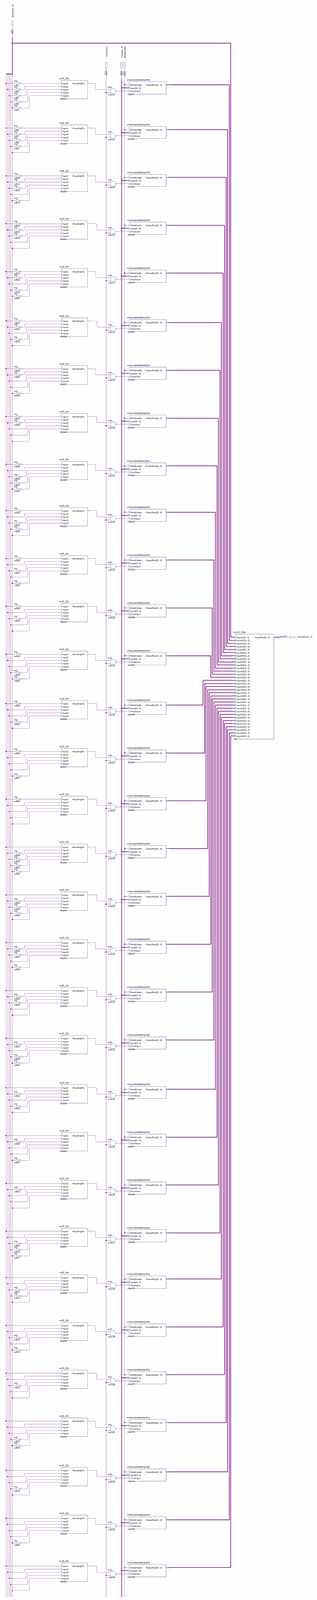
[diagram p0: schematic sheet, whole]
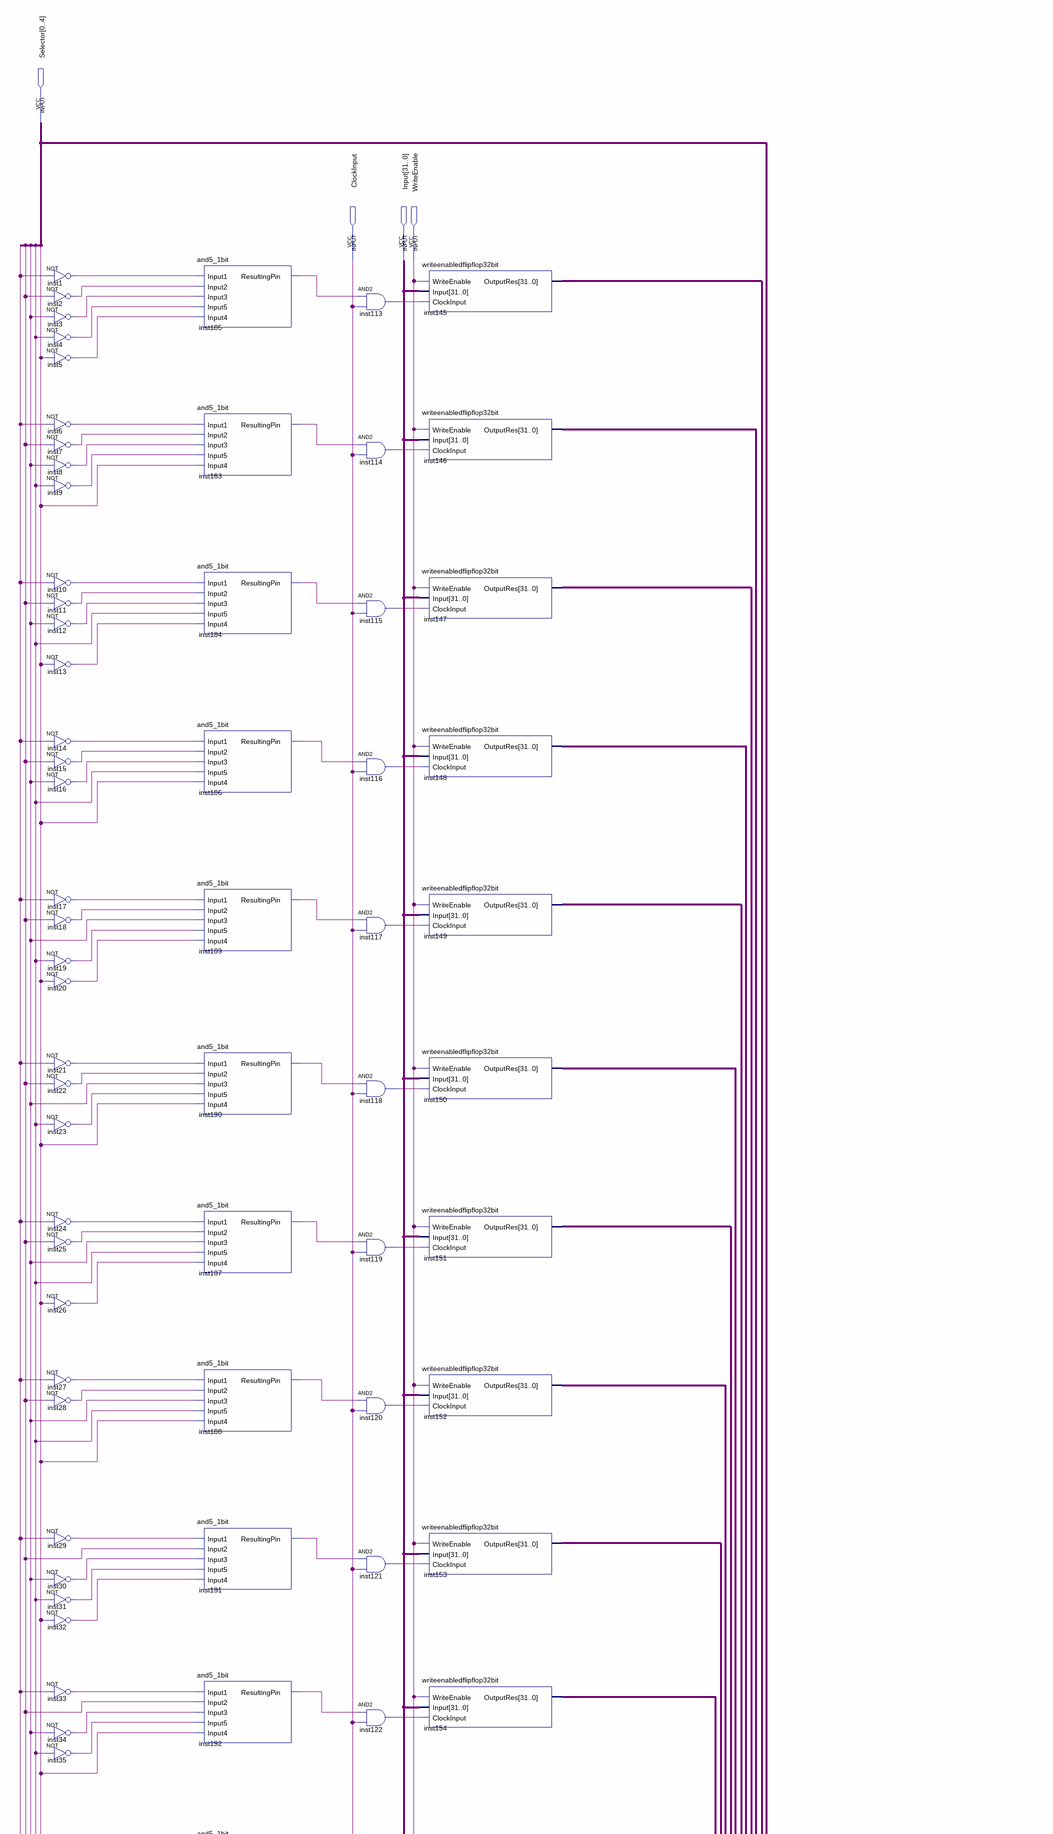
[diagram p1: schematic sheet, upper part]
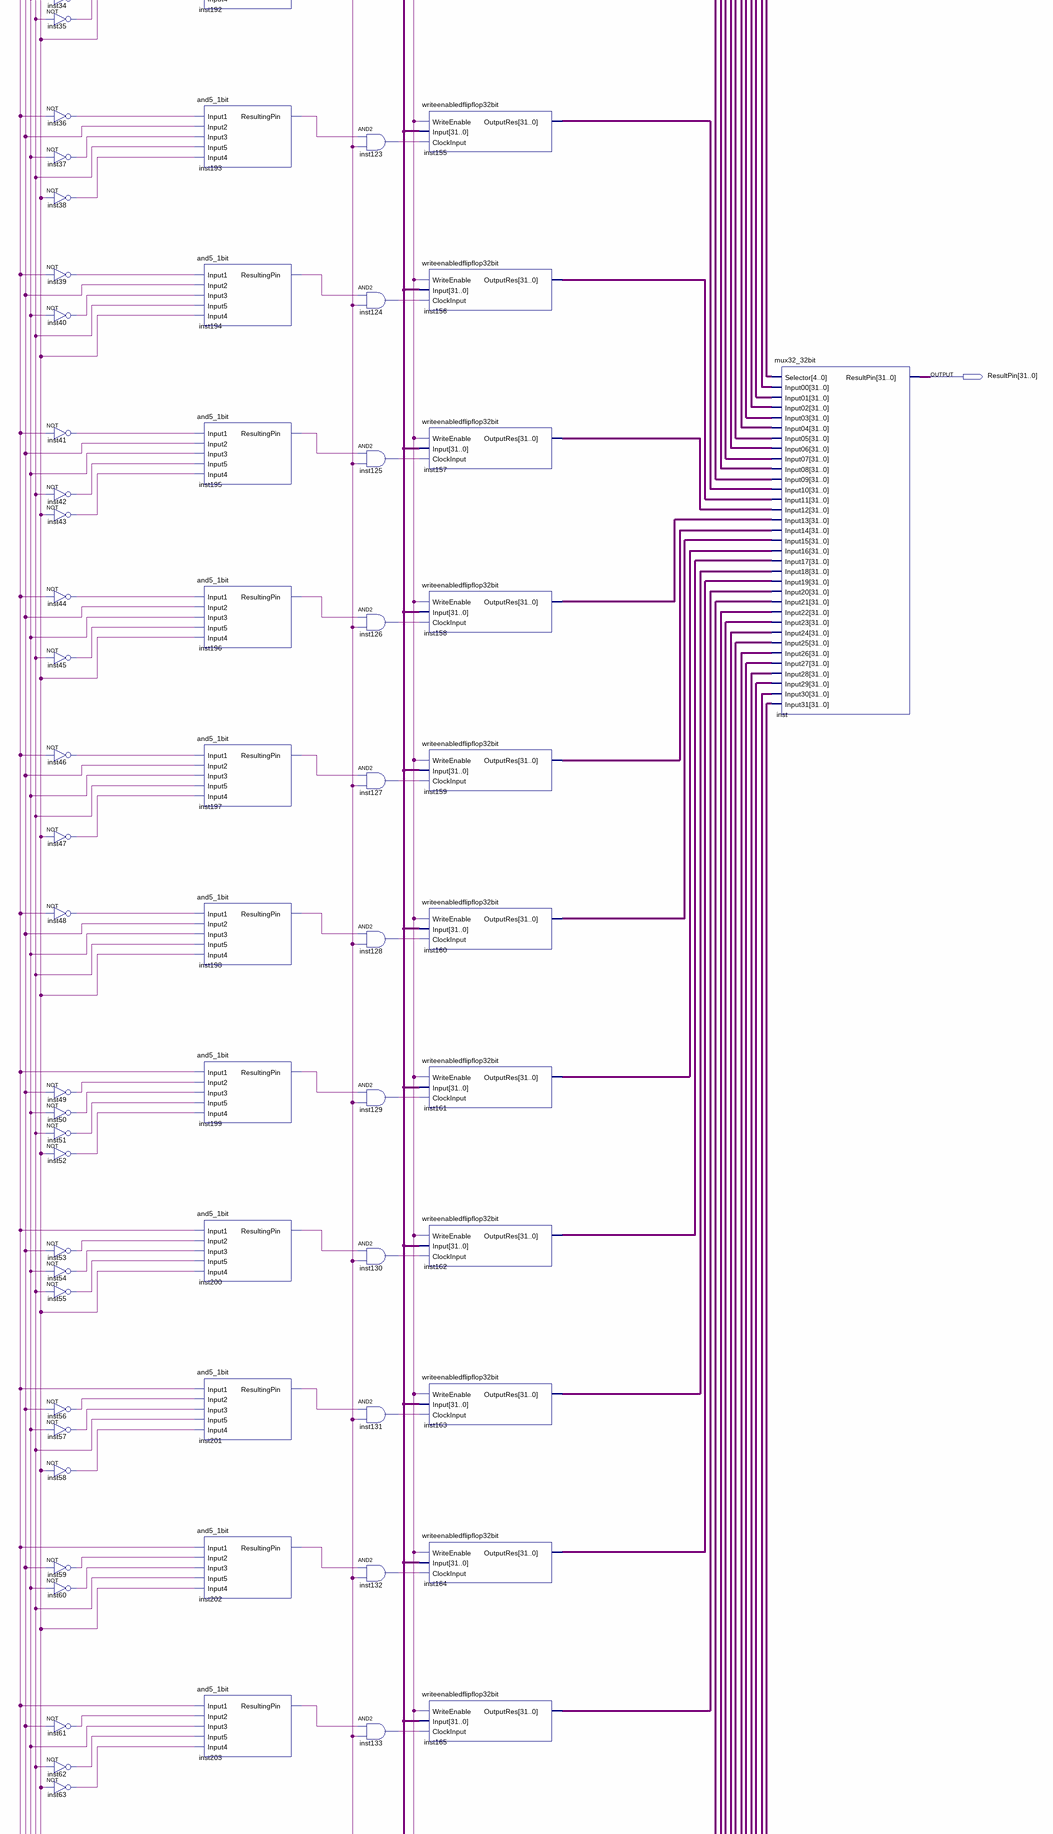
[diagram p2: schematic sheet, middle part]
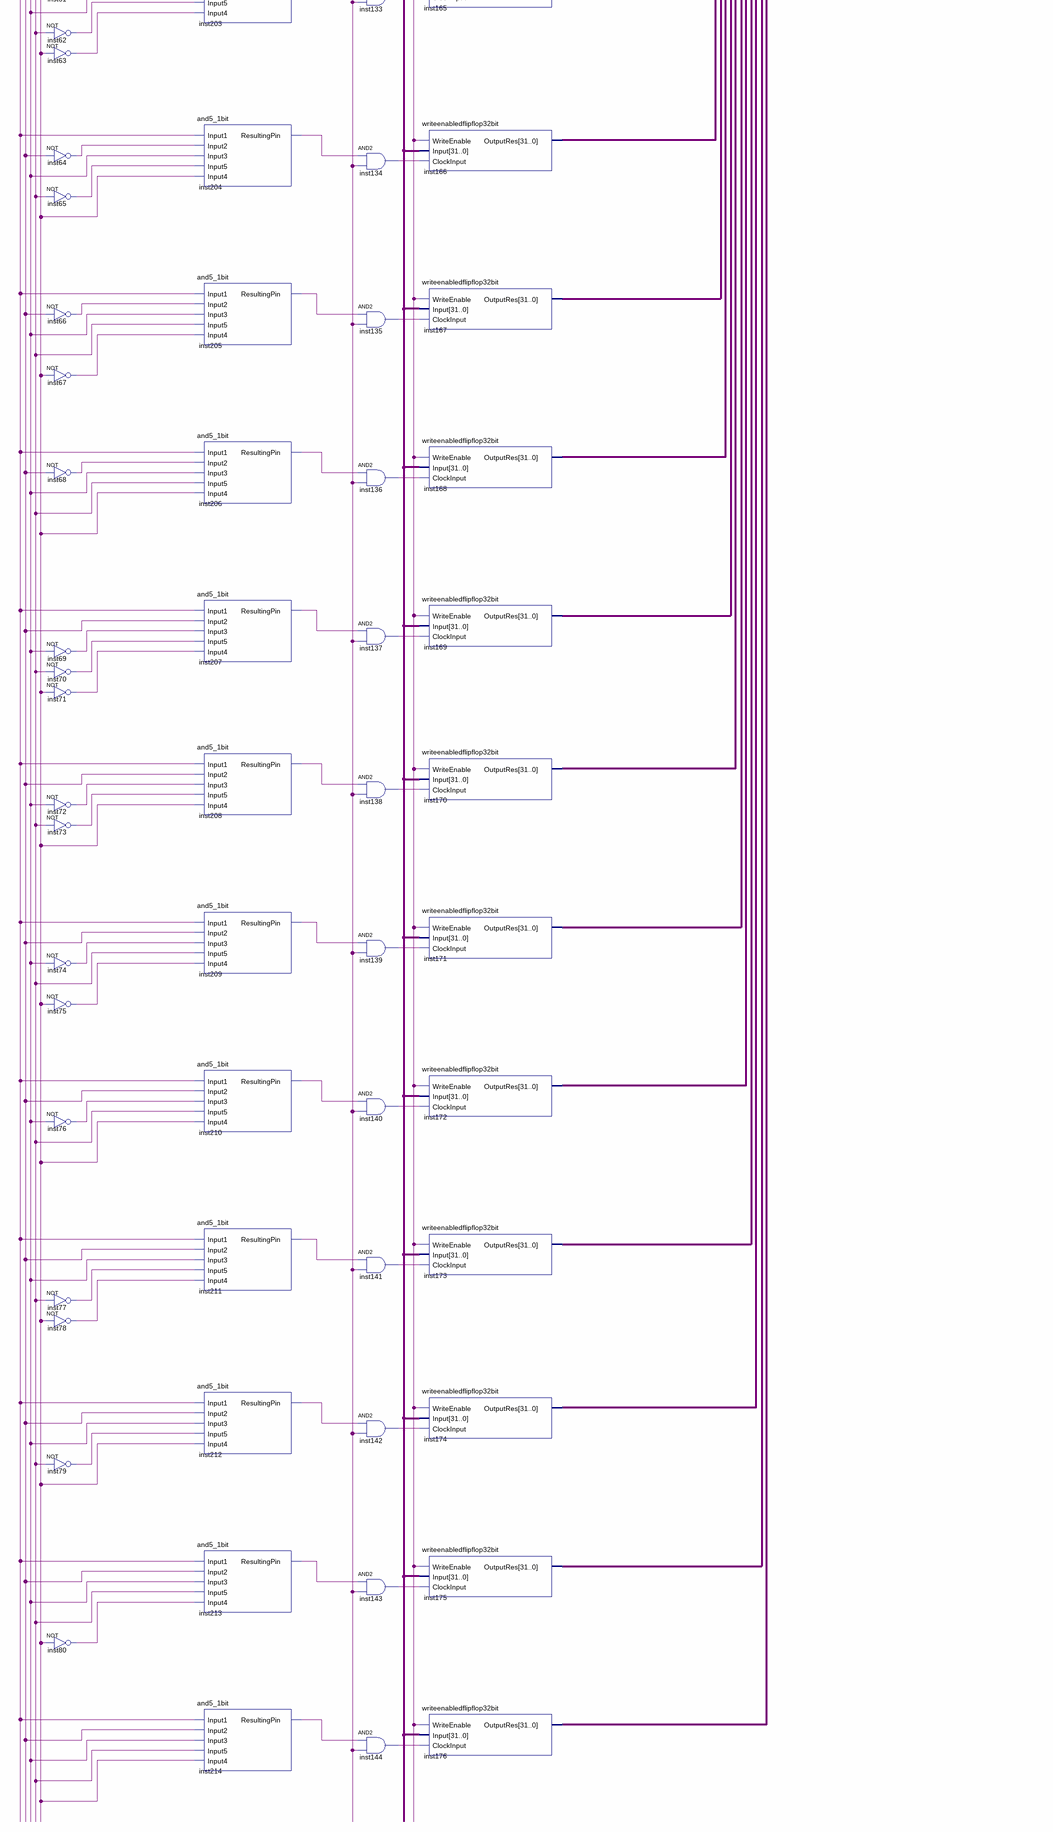
[diagram p3: schematic sheet, lower part]
// Quartus schematic 32writeenabledflipflop32bit.bdf as structural Verilog: 177 symbols, 5 pins
module \32writeenabledflipflop32bit  (
  input  [0:4] Selector,
  input  ClockInput,
  input  [31:0] Input,
  input  WriteEnable,
  output [31:0] ResultPin
);

  wire inst1_out, inst2_out, inst3_out, inst4_out, inst5_out, inst6_out, inst7_out, inst8_out, inst9_out,
       inst10_out, inst11_out, inst12_out, inst13_out, inst14_out, inst15_out, inst16_out, inst17_out,
       inst18_out, inst19_out, inst20_out, inst21_out, inst22_out, inst23_out, inst24_out, inst25_out,
       inst26_out, inst27_out, inst28_out, inst29_out, inst30_out, inst31_out, inst32_out, inst33_out,
       inst34_out, inst35_out, inst36_out, inst37_out, inst38_out, inst39_out, inst40_out, inst41_out,
       inst42_out, inst43_out, inst44_out, inst45_out, inst46_out, inst47_out, inst48_out, inst49_out,
       inst50_out, inst51_out, inst52_out, inst53_out, inst54_out, inst55_out, inst56_out, inst57_out,
       inst58_out, inst59_out, inst60_out, inst61_out, inst62_out, inst63_out, inst64_out, inst65_out,
       inst66_out, inst67_out, inst68_out, inst69_out, inst70_out, inst71_out, inst72_out, inst73_out,
       inst74_out, inst75_out, inst76_out, inst77_out, inst78_out, inst79_out, inst80_out, inst113_out,
       inst114_out, inst115_out, inst116_out, inst117_out, inst118_out, inst119_out, inst120_out,
       inst121_out, inst122_out, inst123_out, inst124_out, inst125_out, inst126_out, inst127_out,
       inst128_out, inst129_out, inst130_out, inst131_out, inst132_out, inst133_out, inst134_out,
       inst135_out, inst136_out, inst137_out, inst138_out, inst139_out, inst140_out, inst141_out,
       inst142_out, inst143_out, inst144_out, inst183_resultingpin, inst184_resultingpin,
       inst185_resultingpin, inst186_resultingpin, inst187_resultingpin, inst188_resultingpin,
       inst189_resultingpin, inst190_resultingpin, inst191_resultingpin, inst192_resultingpin,
       inst193_resultingpin, inst194_resultingpin, inst195_resultingpin, inst196_resultingpin,
       inst197_resultingpin, inst198_resultingpin, inst199_resultingpin, inst200_resultingpin,
       inst201_resultingpin, inst202_resultingpin, inst203_resultingpin, inst204_resultingpin,
       inst205_resultingpin, inst206_resultingpin, inst207_resultingpin, inst208_resultingpin,
       inst209_resultingpin, inst210_resultingpin, inst211_resultingpin, inst212_resultingpin,
       inst213_resultingpin, inst214_resultingpin;
  wire [31:0] inst145_outputres, inst146_outputres, inst147_outputres, inst148_outputres, inst149_outputres,
       inst150_outputres, inst151_outputres, inst152_outputres, inst153_outputres, inst154_outputres,
       inst155_outputres, inst156_outputres, inst157_outputres, inst158_outputres, inst159_outputres,
       inst160_outputres, inst161_outputres, inst162_outputres, inst163_outputres, inst164_outputres,
       inst165_outputres, inst166_outputres, inst167_outputres, inst168_outputres, inst169_outputres,
       inst170_outputres, inst171_outputres, inst172_outputres, inst173_outputres, inst174_outputres,
       inst175_outputres, inst176_outputres;

  not inst1 (inst1_out, Selector[4]);
  not inst2 (inst2_out, Selector[3]);
  not inst3 (inst3_out, Selector[2]);
  not inst4 (inst4_out, Selector[1]);
  not inst5 (inst5_out, Selector[0]);
  not inst6 (inst6_out, Selector[4]);
  not inst7 (inst7_out, Selector[3]);
  not inst8 (inst8_out, Selector[2]);
  not inst9 (inst9_out, Selector[1]);
  not inst10 (inst10_out, Selector[4]);
  not inst11 (inst11_out, Selector[3]);
  not inst12 (inst12_out, Selector[2]);
  not inst13 (inst13_out, Selector[0]);
  not inst14 (inst14_out, Selector[4]);
  not inst15 (inst15_out, Selector[3]);
  not inst16 (inst16_out, Selector[2]);
  not inst17 (inst17_out, Selector[4]);
  not inst18 (inst18_out, Selector[3]);
  not inst19 (inst19_out, Selector[1]);
  not inst20 (inst20_out, Selector[0]);
  not inst21 (inst21_out, Selector[4]);
  not inst22 (inst22_out, Selector[3]);
  not inst23 (inst23_out, Selector[1]);
  not inst24 (inst24_out, Selector[4]);
  not inst25 (inst25_out, Selector[3]);
  not inst26 (inst26_out, Selector[0]);
  not inst27 (inst27_out, Selector[4]);
  not inst28 (inst28_out, Selector[3]);
  not inst29 (inst29_out, Selector[4]);
  not inst30 (inst30_out, Selector[2]);
  not inst31 (inst31_out, Selector[1]);
  not inst32 (inst32_out, Selector[0]);
  not inst33 (inst33_out, Selector[4]);
  not inst34 (inst34_out, Selector[2]);
  not inst35 (inst35_out, Selector[1]);
  not inst36 (inst36_out, Selector[4]);
  not inst37 (inst37_out, Selector[2]);
  not inst38 (inst38_out, Selector[0]);
  not inst39 (inst39_out, Selector[4]);
  not inst40 (inst40_out, Selector[2]);
  not inst41 (inst41_out, Selector[4]);
  not inst42 (inst42_out, Selector[1]);
  not inst43 (inst43_out, Selector[0]);
  not inst44 (inst44_out, Selector[4]);
  not inst45 (inst45_out, Selector[1]);
  not inst46 (inst46_out, Selector[4]);
  not inst47 (inst47_out, Selector[0]);
  not inst48 (inst48_out, Selector[4]);
  not inst49 (inst49_out, Selector[3]);
  not inst50 (inst50_out, Selector[2]);
  not inst51 (inst51_out, Selector[1]);
  not inst52 (inst52_out, Selector[0]);
  not inst53 (inst53_out, Selector[3]);
  not inst54 (inst54_out, Selector[2]);
  not inst55 (inst55_out, Selector[1]);
  not inst56 (inst56_out, Selector[3]);
  not inst57 (inst57_out, Selector[2]);
  not inst58 (inst58_out, Selector[0]);
  not inst59 (inst59_out, Selector[3]);
  not inst60 (inst60_out, Selector[2]);
  not inst61 (inst61_out, Selector[3]);
  not inst62 (inst62_out, Selector[1]);
  not inst63 (inst63_out, Selector[0]);
  not inst64 (inst64_out, Selector[3]);
  not inst65 (inst65_out, Selector[1]);
  not inst66 (inst66_out, Selector[3]);
  not inst67 (inst67_out, Selector[0]);
  not inst68 (inst68_out, Selector[3]);
  not inst69 (inst69_out, Selector[2]);
  not inst70 (inst70_out, Selector[1]);
  not inst71 (inst71_out, Selector[0]);
  not inst72 (inst72_out, Selector[2]);
  not inst73 (inst73_out, Selector[1]);
  not inst74 (inst74_out, Selector[2]);
  not inst75 (inst75_out, Selector[0]);
  not inst76 (inst76_out, Selector[2]);
  not inst77 (inst77_out, Selector[1]);
  not inst78 (inst78_out, Selector[0]);
  not inst79 (inst79_out, Selector[1]);
  not inst80 (inst80_out, Selector[0]);
  and5_1bit inst185 (
    .Input1(inst1_out), .Input2(inst2_out), .Input3(inst3_out), .Input5(inst4_out), .Input4(inst5_out),
    .ResultingPin(inst185_resultingpin));
  and5_1bit inst183 (
    .Input1(inst6_out), .Input2(inst7_out), .Input3(inst8_out), .Input5(inst9_out), .Input4(Selector[0]),
    .ResultingPin(inst183_resultingpin));
  and5_1bit inst184 (
    .Input1(inst10_out), .Input2(inst11_out), .Input3(inst12_out), .Input5(Selector[1]), .Input4(inst13_out),
    .ResultingPin(inst184_resultingpin));
  and5_1bit inst186 (
    .Input1(inst14_out), .Input2(inst15_out), .Input3(inst16_out), .Input5(Selector[1]),
    .Input4(Selector[0]), .ResultingPin(inst186_resultingpin));
  and5_1bit inst189 (
    .Input1(inst17_out), .Input2(inst18_out), .Input3(Selector[2]), .Input5(inst19_out), .Input4(inst20_out),
    .ResultingPin(inst189_resultingpin));
  and5_1bit inst190 (
    .Input1(inst21_out), .Input2(inst22_out), .Input3(Selector[2]), .Input5(inst23_out),
    .Input4(Selector[0]), .ResultingPin(inst190_resultingpin));
  and5_1bit inst187 (
    .Input1(inst24_out), .Input2(inst25_out), .Input3(Selector[2]), .Input5(Selector[1]),
    .Input4(inst26_out), .ResultingPin(inst187_resultingpin));
  and5_1bit inst188 (
    .Input1(inst27_out), .Input2(inst28_out), .Input3(Selector[2]), .Input5(Selector[1]),
    .Input4(Selector[0]), .ResultingPin(inst188_resultingpin));
  and5_1bit inst191 (
    .Input1(inst29_out), .Input2(Selector[3]), .Input3(inst30_out), .Input5(inst31_out), .Input4(inst32_out),
    .ResultingPin(inst191_resultingpin));
  and5_1bit inst192 (
    .Input1(inst33_out), .Input2(Selector[3]), .Input3(inst34_out), .Input5(inst35_out),
    .Input4(Selector[0]), .ResultingPin(inst192_resultingpin));
  and5_1bit inst193 (
    .Input1(inst36_out), .Input2(Selector[3]), .Input3(inst37_out), .Input5(Selector[1]),
    .Input4(inst38_out), .ResultingPin(inst193_resultingpin));
  and5_1bit inst194 (
    .Input1(inst39_out), .Input2(Selector[3]), .Input3(inst40_out), .Input5(Selector[1]),
    .Input4(Selector[0]), .ResultingPin(inst194_resultingpin));
  and5_1bit inst195 (
    .Input1(inst41_out), .Input2(Selector[3]), .Input3(Selector[2]), .Input5(inst42_out),
    .Input4(inst43_out), .ResultingPin(inst195_resultingpin));
  and5_1bit inst196 (
    .Input1(inst44_out), .Input2(Selector[3]), .Input3(Selector[2]), .Input5(inst45_out),
    .Input4(Selector[0]), .ResultingPin(inst196_resultingpin));
  and5_1bit inst197 (
    .Input1(inst46_out), .Input2(Selector[3]), .Input3(Selector[2]), .Input5(Selector[1]),
    .Input4(inst47_out), .ResultingPin(inst197_resultingpin));
  and5_1bit inst198 (
    .Input1(inst48_out), .Input2(Selector[3]), .Input3(Selector[2]), .Input5(Selector[1]),
    .Input4(Selector[0]), .ResultingPin(inst198_resultingpin));
  and5_1bit inst199 (
    .Input1(Selector[4]), .Input2(inst49_out), .Input3(inst50_out), .Input5(inst51_out), .Input4(inst52_out),
    .ResultingPin(inst199_resultingpin));
  and5_1bit inst200 (
    .Input1(Selector[4]), .Input2(inst53_out), .Input3(inst54_out), .Input5(inst55_out),
    .Input4(Selector[0]), .ResultingPin(inst200_resultingpin));
  and5_1bit inst201 (
    .Input1(Selector[4]), .Input2(inst56_out), .Input3(inst57_out), .Input5(Selector[1]),
    .Input4(inst58_out), .ResultingPin(inst201_resultingpin));
  and5_1bit inst202 (
    .Input1(Selector[4]), .Input2(inst59_out), .Input3(inst60_out), .Input5(Selector[1]),
    .Input4(Selector[0]), .ResultingPin(inst202_resultingpin));
  and5_1bit inst203 (
    .Input1(Selector[4]), .Input2(inst61_out), .Input3(Selector[2]), .Input5(inst62_out),
    .Input4(inst63_out), .ResultingPin(inst203_resultingpin));
  and5_1bit inst204 (
    .Input1(Selector[4]), .Input2(inst64_out), .Input3(Selector[2]), .Input5(inst65_out),
    .Input4(Selector[0]), .ResultingPin(inst204_resultingpin));
  and5_1bit inst205 (
    .Input1(Selector[4]), .Input2(inst66_out), .Input3(Selector[2]), .Input5(Selector[1]),
    .Input4(inst67_out), .ResultingPin(inst205_resultingpin));
  and5_1bit inst206 (
    .Input1(Selector[4]), .Input2(inst68_out), .Input3(Selector[2]), .Input5(Selector[1]),
    .Input4(Selector[0]), .ResultingPin(inst206_resultingpin));
  and5_1bit inst207 (
    .Input1(Selector[4]), .Input2(Selector[3]), .Input3(inst69_out), .Input5(inst70_out),
    .Input4(inst71_out), .ResultingPin(inst207_resultingpin));
  and5_1bit inst208 (
    .Input1(Selector[4]), .Input2(Selector[3]), .Input3(inst72_out), .Input5(inst73_out),
    .Input4(Selector[0]), .ResultingPin(inst208_resultingpin));
  and5_1bit inst209 (
    .Input1(Selector[4]), .Input2(Selector[3]), .Input3(inst74_out), .Input5(Selector[1]),
    .Input4(inst75_out), .ResultingPin(inst209_resultingpin));
  and5_1bit inst210 (
    .Input1(Selector[4]), .Input2(Selector[3]), .Input3(inst76_out), .Input5(Selector[1]),
    .Input4(Selector[0]), .ResultingPin(inst210_resultingpin));
  and5_1bit inst211 (
    .Input1(Selector[4]), .Input2(Selector[3]), .Input3(Selector[2]), .Input5(inst77_out),
    .Input4(inst78_out), .ResultingPin(inst211_resultingpin));
  and5_1bit inst212 (
    .Input1(Selector[4]), .Input2(Selector[3]), .Input3(Selector[2]), .Input5(inst79_out),
    .Input4(Selector[0]), .ResultingPin(inst212_resultingpin));
  and5_1bit inst213 (
    .Input1(Selector[4]), .Input2(Selector[3]), .Input3(Selector[2]), .Input5(Selector[1]),
    .Input4(inst80_out), .ResultingPin(inst213_resultingpin));
  and5_1bit inst214 (
    .Input1(Selector[4]), .Input2(Selector[3]), .Input3(Selector[2]), .Input5(Selector[1]),
    .Input4(Selector[0]), .ResultingPin(inst214_resultingpin));
  and inst113 (inst113_out, inst185_resultingpin, ClockInput);
  and inst114 (inst114_out, inst183_resultingpin, ClockInput);
  and inst115 (inst115_out, inst184_resultingpin, ClockInput);
  and inst116 (inst116_out, inst186_resultingpin, ClockInput);
  and inst117 (inst117_out, inst189_resultingpin, ClockInput);
  and inst118 (inst118_out, inst190_resultingpin, ClockInput);
  and inst119 (inst119_out, inst187_resultingpin, ClockInput);
  and inst120 (inst120_out, inst188_resultingpin, ClockInput);
  and inst121 (inst121_out, inst191_resultingpin, ClockInput);
  and inst122 (inst122_out, inst192_resultingpin, ClockInput);
  and inst123 (inst123_out, inst193_resultingpin, ClockInput);
  and inst124 (inst124_out, inst194_resultingpin, ClockInput);
  and inst125 (inst125_out, inst195_resultingpin, ClockInput);
  and inst126 (inst126_out, inst196_resultingpin, ClockInput);
  and inst127 (inst127_out, inst197_resultingpin, ClockInput);
  and inst128 (inst128_out, inst198_resultingpin, ClockInput);
  and inst129 (inst129_out, inst199_resultingpin, ClockInput);
  and inst130 (inst130_out, inst200_resultingpin, ClockInput);
  and inst131 (inst131_out, inst201_resultingpin, ClockInput);
  and inst132 (inst132_out, inst202_resultingpin, ClockInput);
  and inst133 (inst133_out, inst203_resultingpin, ClockInput);
  and inst134 (inst134_out, inst204_resultingpin, ClockInput);
  and inst135 (inst135_out, inst205_resultingpin, ClockInput);
  and inst136 (inst136_out, inst206_resultingpin, ClockInput);
  and inst137 (inst137_out, inst207_resultingpin, ClockInput);
  and inst138 (inst138_out, inst208_resultingpin, ClockInput);
  and inst139 (inst139_out, inst209_resultingpin, ClockInput);
  and inst140 (inst140_out, inst210_resultingpin, ClockInput);
  and inst141 (inst141_out, inst211_resultingpin, ClockInput);
  and inst142 (inst142_out, inst212_resultingpin, ClockInput);
  and inst143 (inst143_out, inst213_resultingpin, ClockInput);
  and inst144 (inst144_out, inst214_resultingpin, ClockInput);
  writeenabledflipflop32bit inst145 (
    .WriteEnable(WriteEnable), .Input(Input), .ClockInput(inst113_out), .OutputRes(inst145_outputres));
  writeenabledflipflop32bit inst146 (
    .WriteEnable(WriteEnable), .Input(Input), .ClockInput(inst114_out), .OutputRes(inst146_outputres));
  writeenabledflipflop32bit inst147 (
    .WriteEnable(WriteEnable), .Input(Input), .ClockInput(inst115_out), .OutputRes(inst147_outputres));
  writeenabledflipflop32bit inst148 (
    .WriteEnable(WriteEnable), .Input(Input), .ClockInput(inst116_out), .OutputRes(inst148_outputres));
  writeenabledflipflop32bit inst149 (
    .WriteEnable(WriteEnable), .Input(Input), .ClockInput(inst117_out), .OutputRes(inst149_outputres));
  writeenabledflipflop32bit inst150 (
    .WriteEnable(WriteEnable), .Input(Input), .ClockInput(inst118_out), .OutputRes(inst150_outputres));
  writeenabledflipflop32bit inst151 (
    .WriteEnable(WriteEnable), .Input(Input), .ClockInput(inst119_out), .OutputRes(inst151_outputres));
  writeenabledflipflop32bit inst152 (
    .WriteEnable(WriteEnable), .Input(Input), .ClockInput(inst120_out), .OutputRes(inst152_outputres));
  writeenabledflipflop32bit inst153 (
    .WriteEnable(WriteEnable), .Input(Input), .ClockInput(inst121_out), .OutputRes(inst153_outputres));
  writeenabledflipflop32bit inst154 (
    .WriteEnable(WriteEnable), .Input(Input), .ClockInput(inst122_out), .OutputRes(inst154_outputres));
  writeenabledflipflop32bit inst155 (
    .WriteEnable(WriteEnable), .Input(Input), .ClockInput(inst123_out), .OutputRes(inst155_outputres));
  writeenabledflipflop32bit inst156 (
    .WriteEnable(WriteEnable), .Input(Input), .ClockInput(inst124_out), .OutputRes(inst156_outputres));
  writeenabledflipflop32bit inst157 (
    .WriteEnable(WriteEnable), .Input(Input), .ClockInput(inst125_out), .OutputRes(inst157_outputres));
  writeenabledflipflop32bit inst158 (
    .WriteEnable(WriteEnable), .Input(Input), .ClockInput(inst126_out), .OutputRes(inst158_outputres));
  writeenabledflipflop32bit inst159 (
    .WriteEnable(WriteEnable), .Input(Input), .ClockInput(inst127_out), .OutputRes(inst159_outputres));
  writeenabledflipflop32bit inst160 (
    .WriteEnable(WriteEnable), .Input(Input), .ClockInput(inst128_out), .OutputRes(inst160_outputres));
  writeenabledflipflop32bit inst161 (
    .WriteEnable(WriteEnable), .Input(Input), .ClockInput(inst129_out), .OutputRes(inst161_outputres));
  writeenabledflipflop32bit inst162 (
    .WriteEnable(WriteEnable), .Input(Input), .ClockInput(inst130_out), .OutputRes(inst162_outputres));
  writeenabledflipflop32bit inst163 (
    .WriteEnable(WriteEnable), .Input(Input), .ClockInput(inst131_out), .OutputRes(inst163_outputres));
  writeenabledflipflop32bit inst164 (
    .WriteEnable(WriteEnable), .Input(Input), .ClockInput(inst132_out), .OutputRes(inst164_outputres));
  writeenabledflipflop32bit inst165 (
    .WriteEnable(WriteEnable), .Input(Input), .ClockInput(inst133_out), .OutputRes(inst165_outputres));
  writeenabledflipflop32bit inst166 (
    .WriteEnable(WriteEnable), .Input(Input), .ClockInput(inst134_out), .OutputRes(inst166_outputres));
  writeenabledflipflop32bit inst167 (
    .WriteEnable(WriteEnable), .Input(Input), .ClockInput(inst135_out), .OutputRes(inst167_outputres));
  writeenabledflipflop32bit inst168 (
    .WriteEnable(WriteEnable), .Input(Input), .ClockInput(inst136_out), .OutputRes(inst168_outputres));
  writeenabledflipflop32bit inst169 (
    .WriteEnable(WriteEnable), .Input(Input), .ClockInput(inst137_out), .OutputRes(inst169_outputres));
  writeenabledflipflop32bit inst170 (
    .WriteEnable(WriteEnable), .Input(Input), .ClockInput(inst138_out), .OutputRes(inst170_outputres));
  writeenabledflipflop32bit inst171 (
    .WriteEnable(WriteEnable), .Input(Input), .ClockInput(inst139_out), .OutputRes(inst171_outputres));
  writeenabledflipflop32bit inst172 (
    .WriteEnable(WriteEnable), .Input(Input), .ClockInput(inst140_out), .OutputRes(inst172_outputres));
  writeenabledflipflop32bit inst173 (
    .WriteEnable(WriteEnable), .Input(Input), .ClockInput(inst141_out), .OutputRes(inst173_outputres));
  writeenabledflipflop32bit inst174 (
    .WriteEnable(WriteEnable), .Input(Input), .ClockInput(inst142_out), .OutputRes(inst174_outputres));
  writeenabledflipflop32bit inst175 (
    .WriteEnable(WriteEnable), .Input(Input), .ClockInput(inst143_out), .OutputRes(inst175_outputres));
  writeenabledflipflop32bit inst176 (
    .WriteEnable(WriteEnable), .Input(Input), .ClockInput(inst144_out), .OutputRes(inst176_outputres));
  mux32_32bit inst (
    .Selector(Selector), .Input00(inst145_outputres), .Input01(inst146_outputres),
    .Input02(inst147_outputres), .Input03(inst148_outputres), .Input04(inst149_outputres),
    .Input05(inst150_outputres), .Input06(inst151_outputres), .Input07(inst152_outputres),
    .Input08(inst153_outputres), .Input09(inst154_outputres), .Input10(inst155_outputres),
    .Input11(inst156_outputres), .Input12(inst157_outputres), .Input13(inst158_outputres),
    .Input14(inst159_outputres), .Input15(inst160_outputres), .Input16(inst161_outputres),
    .Input17(inst162_outputres), .Input18(inst163_outputres), .Input19(inst164_outputres),
    .Input20(inst165_outputres), .Input21(inst166_outputres), .Input22(inst167_outputres),
    .Input23(inst168_outputres), .Input24(inst169_outputres), .Input25(inst170_outputres),
    .Input26(inst171_outputres), .Input27(inst172_outputres), .Input28(inst173_outputres),
    .Input29(inst174_outputres), .Input30(inst175_outputres), .Input31(inst176_outputres),
    .ResultPin(ResultPin));
endmodule
